# EAGLE design picoAva-Rev2 (EAGLE 6.2)
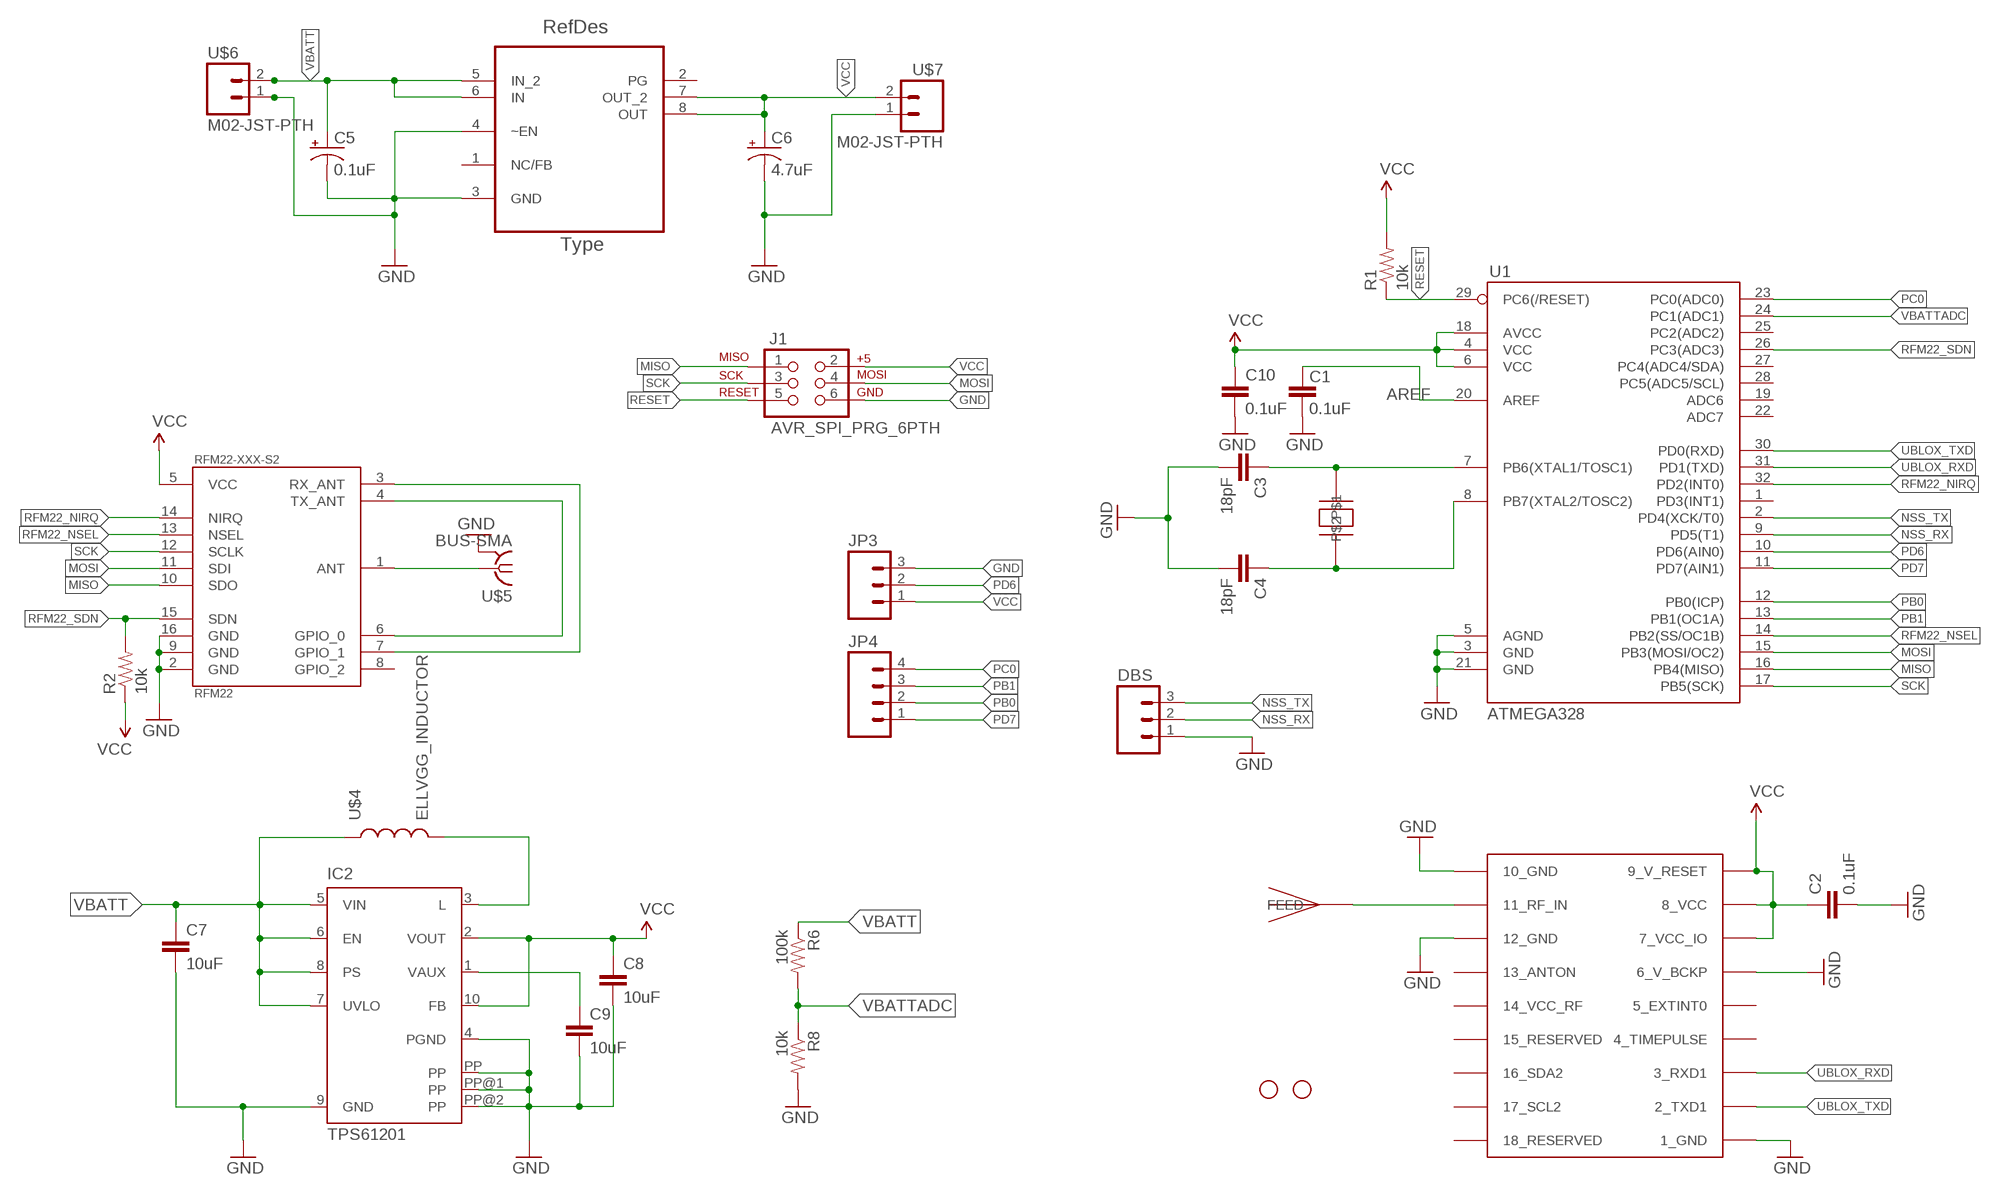
[diagram p0: schematic, sheet 1]

## Parts
C1  0.1uF  CAP0402-CAP  [0402-CAP]
C2  0.1uF  CAP0402-CAP  [0402-CAP]
C3  18pF  CAP0402-CAP  [0402-CAP]
C4  18pF  CAP0402-CAP  [0402-CAP]
C5  0.1uF  CAP_POL1206-KIT  [EIA3216-KIT]
C6  4.7uF  CAP_POL1206-KIT  [EIA3216-KIT]
C7  10uF  CAP1206  [1206]
C8  10uF  CAP1206  [1206]
C9  10uF  CAP1206  [1206]
C10  0.1uF  CAP0402-CAP  [0402-CAP]
DBS  M03PTH  [1X03]
IC2  TPS61201  [S-PDSO-N10]
J1  AVR_SPI_PRG_6PTH  [2X3]
JP1  STAND-OFF  [STAND-OFF]
JP2  STAND-OFF  [STAND-OFF]
JP3  M03PTH  [1X03]
JP4  M04PTH  [1X04]
R1  10k  RESISTOR0402-RES  [0402-RES]
R2  10k  RESISTOR0402-RES  [0402-RES]
R6  100k  RESISTOR0402-RES  [0402-RES]
R8  10k  RESISTOR0402-RES  [0402-RES]
RFM22-XXX-S2  RFM22  [RFM22-XXX-S2]
U1  ATMEGA328  ATMEGA168  [TQFP32-08]
U2  TPS76633D  [SOIC127P600X175-8N]
U$1  UBLOX_MAX-6  [UBLOX_MAX-6]
U$2  ABRACON_ABM3_CRYSTAL  [ABRACON_ABM3_CRYSTAL]
U$3  JTI_ANTENNA-1575AT43A40  [JTI_ANTENNA-1575AT43A40]
U$4  ELLVGG_INDUCTOR  [ELLVGG_INDUCTOR]
U$5  BUS-SMA  [BUS-SMA]
U$6  M02-JST-PTH  [M02-JST-PTH]
U$7  M02-JST-PTH  [M02-JST-PTH]

## Nets
AREF: C1.2 U1.20(AREF)
GND [vcc]: C1.1 C2.2 C3.2 C4.2 C5.C(-) C6.C(-) C7.2 C8.2 C9.2 C10.2 DBS.1 IC2.4(PGND) IC2.9(GND) IC2.PP IC2.PP@1(PP) IC2.PP@2(PP) J1.6 JP3.3 R8.2 RFM22-XXX-S2.2(GND) RFM22-XXX-S2.9(GND) RFM22-XXX-S2.16(GND) U1.3(GND) U1.5(AGND) U1.21(GND) U2.3(GND) U2.4(~EN) U$1.1_GND U$1.6_V_BCKP U$1.10_GND U$1.12_GND U$5.2(GND) U$5.3(GND) U$5.4(GND) U$5.5(GND) U$6.1 U$7.1
MISO: J1.1 RFM22-XXX-S2.10(SDO) U1.16(PB4(MISO))
MOSI: J1.4 RFM22-XXX-S2.11(SDI) U1.15(PB3(MOSI/OC2))
N$3: RFM22-XXX-S2.1(ANT) U$5.1
N$4: U$1.11_RF_IN U$3.FEED
N$5: RFM22-XXX-S2.3(RX_ANT) RFM22-XXX-S2.7(GPIO_1)
N$6: RFM22-XXX-S2.4(TX_ANT) RFM22-XXX-S2.6(GPIO_0)
N$7: IC2.3(L) U$4.P$2
N$9: C3.1 U1.7(PB6(XTAL1/TOSC1)) U$2.P$2
N$10: C4.1 U1.8(PB7(XTAL2/TOSC2)) U$2.P$1
N$11: C9.1 IC2.1(VAUX)
NSS_RX: DBS.2 U1.9(PD5(T1))
NSS_TX: DBS.3 U1.2(PD4(XCK/T0))
PB0: JP4.2 U1.12(PB0(ICP))
PB1: JP4.3 U1.13(PB1(OC1A))
PC0: JP4.4 U1.23(PC0(ADC0))
PD6: JP3.2 U1.10(PD6(AIN0))
PD7: JP4.1 U1.11(PD7(AIN1))
RESET: J1.5 R1.1 U1.29(PC6(/RESET))
RFM22_NIRQ: RFM22-XXX-S2.14(NIRQ) U1.32(PD2(INT0))
RFM22_NSEL: RFM22-XXX-S2.13(NSEL) U1.14(PB2(SS/OC1B))
RFM22_SDN: R2.2 RFM22-XXX-S2.15(SDN) U1.26(PC3(ADC3))
SCK: J1.3 RFM22-XXX-S2.12(SCLK) U1.17(PB5(SCK))
UBLOX_RXD: U1.31(PD1(TXD)) U$1.3_RXD1
UBLOX_TXD: U1.30(PD0(RXD)) U$1.2_TXD1
VBATT [vcc]: C5.A(+) C7.1 IC2.5(VIN) IC2.6(EN) IC2.7(UVLO) IC2.8(PS) R6.1 U2.5(IN_2) U2.6(IN) U$4.P$1 U$6.2
VBATTADC: R6.2 R8.1 U1.24(PC1(ADC1))
VCC: C2.1 C6.A(+) C8.1 C10.1 IC2.2(VOUT) IC2.10(FB) J1.2 JP3.1 R1.2 R2.1 RFM22-XXX-S2.5(VCC) U1.4(VCC) U1.6(VCC) U1.18(AVCC) U2.7(OUT_2) U2.8(OUT) U$1.7_VCC_IO U$1.8_VCC U$1.9_V_RESET U$7.2
Unconnected: RFM22-XXX-S2.8(GPIO_2) U1.1(PD3(INT1)) U1.19(ADC6) U1.22(ADC7) U1.25(PC2(ADC2)) U1.27(PC4(ADC4/SDA)) U1.28(PC5(ADC5/SCL)) U2.1(NC/FB) U2.2(PG) U$1.4_TIMEPULSE U$1.5_EXTINT0 U$1.13_ANTON U$1.14_VCC_RF U$1.15_RESERVED U$1.16_SDA2 U$1.17_SCL2 U$1.18_RESERVED

## Library data of the parts
C1-C4 C7-C10 = SparkFun:CAP: Capacitor Standard 0603 ceramic capacitor, and 0.1" leaded capacitor.
C5 C6 = SparkFun:CAP_POL: Capacitor Polarized These are standard SMD and PTH capacitors. Normally 10uF, 47uF, and 100uF in electrolytic and tantalum varieties. Always verify the external diameter of the through hole cap, it varies with capacity, voltage, and manufacturer. The EIA devices should be standard.
DBS JP3 = SparkFun:M03: Header 3 Standard 3-pin 0.1" header. Use with straight break away headers (SKU : PRT-00116), right angle break away headers (PRT-00553), swiss pins (PRT-00743), machine pins (PRT-00117), and female headers (PRT-00115). Molex polarized connector foot print use with SKU : PRT-08232 with associated crimp pins and housings.
IC2 = texas:TPS6120*: LOW INPUT VOLTAGE SYNCHRONOUS BOOST CONVERTER WITH 1.3-A SWITCHES Source: http://focus.ti.com/lit/ds/symlink/tps61200.pdf; MPN: TPS61201DRCT; OC_FARNELL: unknown; OC_NEWARK: 37M0068
J1 = SparkFun:AVR_SPI_PRG_6: AVR ISP 6 Pin This is the reduced ISP connector for AVR programming. Common on Arduino. This footprint will take up less PCB space and can be used with a 10-pin to 6-pin adapter such as SKU: BOB-08508
JP1 JP2 = SparkFun:STAND-OFF: Stand Off This is the mechanical footprint for a #4 phillips button head screw. Use the keepout ring to avoid running the screw head into surrounding components. SKU : PRT-00447
JP4 = SparkFun:M04: Header 4 Standard 4-pin 0.1" header. Use with straight break away headers (SKU : PRT-00116), right angle break away headers (PRT-00553), swiss pins (PRT-00743), machine pins (PRT-00117), and female headers (PRT-00115). Molex polarized connector foot print use with SKU : PRT-08231 with associated crimp pins and housings. 1MM SMD Version SKU: PRT-10208
R1 R2 R6 R8 = SparkFun:RESISTOR: Resistor Basic schematic elements and footprints for 0603, 1206, and PTH resistors.
RFM22-XXX-S2 = SparkFun:RFM22: *Hope RF's RFM22* Packages: RFM22-S2 (SMD)
U1 = SparkFun:ATMEGA168
U2 = ava:TPS76633D; DESCRIPTION: ULTRALOW QUIESCENT CURRENT 250-mA LOW DROPOUT VOLTAGE REGULATORS; MPN: TPS76633D; OC_FARNELL: 8461422; OC_NEWARK: 77C1060; PACKAGE: SOIC-8; SUPPLIER: Texas Instruments
U$1 = ava:UBLOX_MAX-6: UBLOX MAX-6
U$2 = ava:ABRACON_ABM3_CRYSTAL
U$3 = ava:JTI_ANTENNA-1575AT43A40
U$4 = ava:ELLVGG_INDUCTOR
U$5 = ava:BUS-SMA
U$6 U$7 = ava:M02-JST-PTH

## Net classes
0 default: width 0.203 mm
1 vcc: width 0.254 mm

## Board
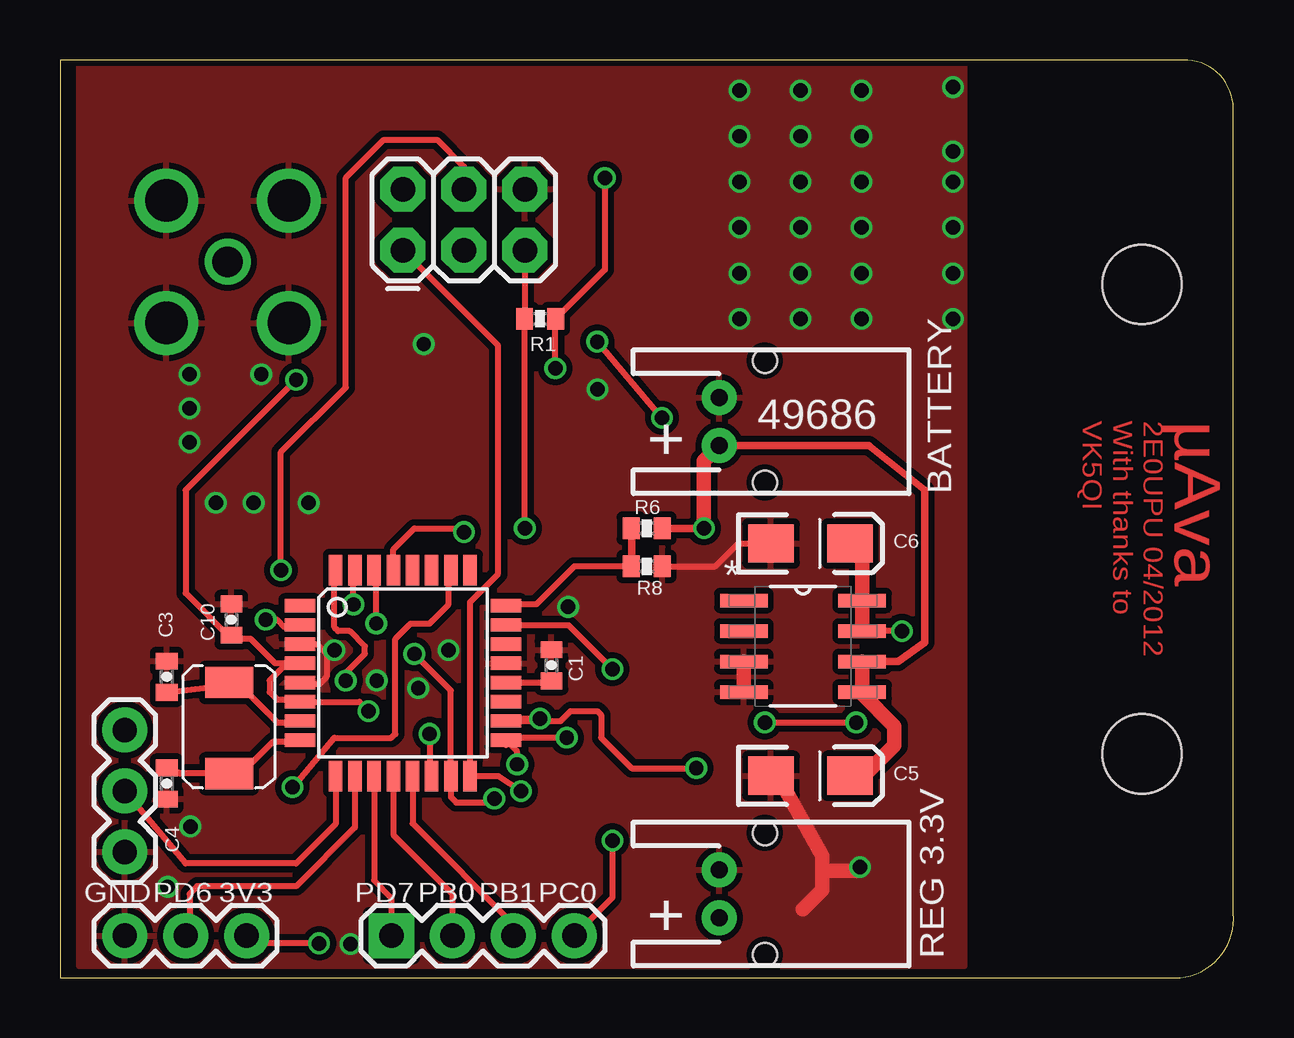
[diagram p1: board, top side]
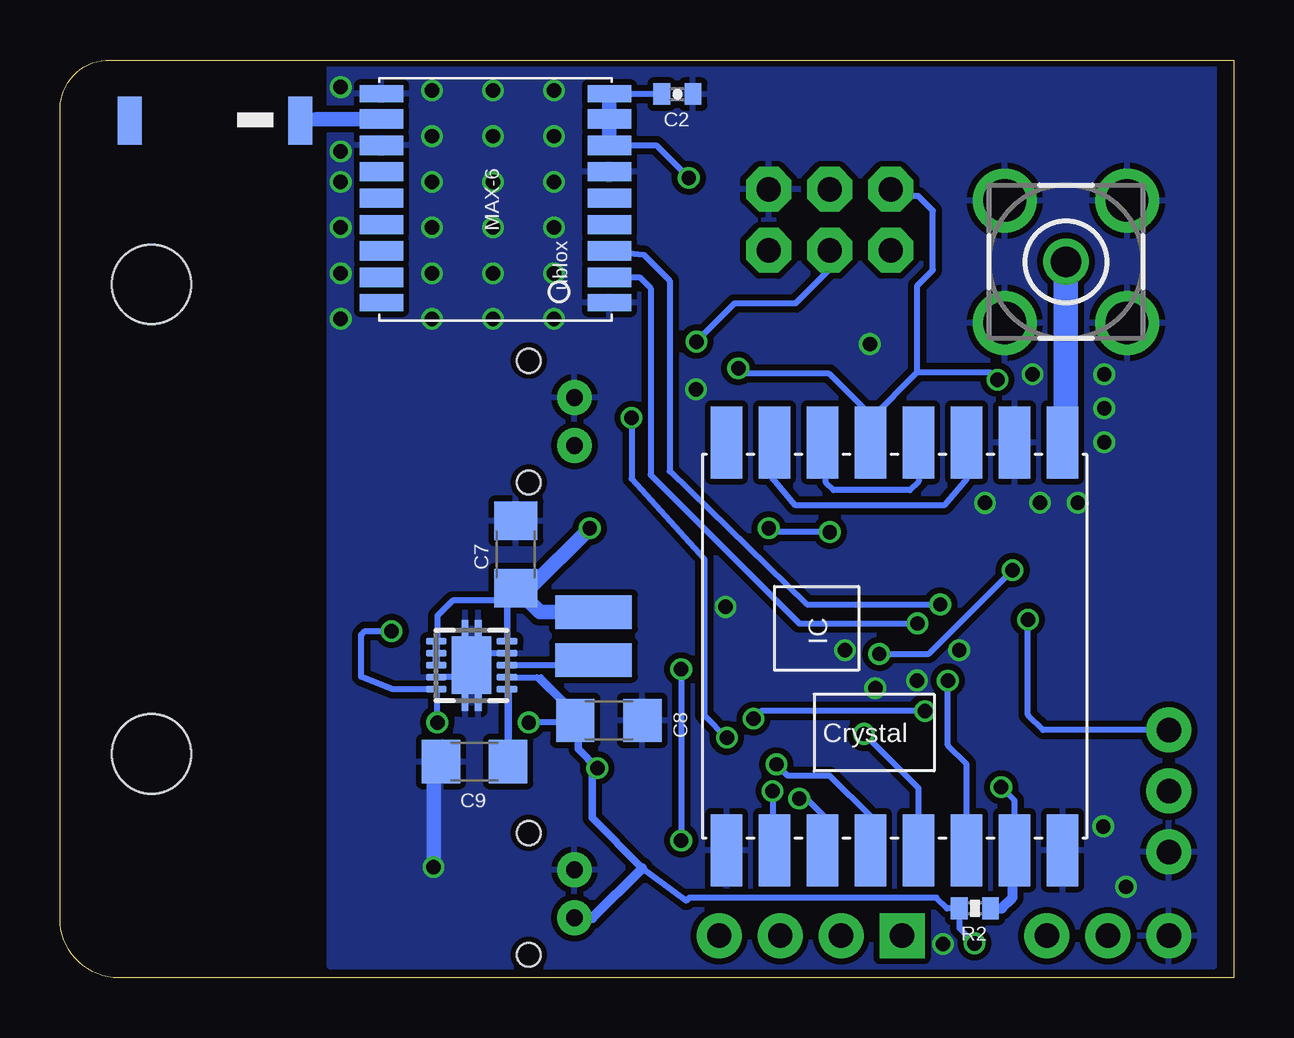
[diagram p2: board, bottom side, seen from below]

Size 48.9 x 38.25 mm. Coordinates in mm from the lower left corner, seen from the top.
Outline: 0,0 46.68,0 arc90 48.89,2.69 48.89,36.04 arc90 46.99,38.25 0,38.25 0,0
Copper layers (1*16): Top 0.035mm / dielectric 1.5mm / Bottom 0.035mm
Design rules: minimum track width 6mil, minimum drill 12mil, track to track 6mil, track to pad 6mil, pad to pad 6mil, via to via 6mil, smd to smd 0mil, copper to edge 10mil, drill to drill 10mil, minimum pad ring 10mil, minimum via ring 6mil, stop-mask expansion 2mil, vias tented up to drill 100mil, thermal gap 10mil

### Footprints (pad centres in the part's own frame; a part is rotated, then mirrored left to right if it is on the bottom)
0402-CAP = smd 0.7 x 0.9: 1 -0.65,0; 2 0.65,0
EIA3216-KIT = smd 1.9 x 1.6: A 1.65,0; C -1.65,0
1206 = smd 1.6 x 1.8: 1 -1.4,0; 2 1.4,0
1X03 = drill 1.016 pad 1.88: 1 0,0; 2 2.54,0; 3 5.08,0
S-PDSO-N10 = smd 0.28 x 0.85: 1 -1,-1.475; 2 -0.5,-1.475; 3 0,-1.475; 4 0.5,-1.475; 5 1,-1.475; 6 1,1.475; 7 0.5,1.475; 8 0,1.475; 9 -0.5,1.475; 10 -1,1.475 | smd 2.4 x 1.65: PP 0,0 | smd 3.8 x 0.28: PP@1 0,0.275; PP@2 0,-0.275
2X3 = drill 1.016 pad 1.88 octagon: 1 0,0; 2 0,2.54; 3 2.54,0; 4 2.54,2.54; 5 5.08,0; 6 5.08,2.54
STAND-OFF = hole 3.302: 0,0
1X04 = drill 1.016 pad 1.88 square: 1 0,0 | drill 1.016 pad 1.88: 2 2.54,0; 3 5.08,0; 4 7.62,0
0402-RES = smd 0.7 x 0.9: 1 -0.65,0; 2 0.65,0
RFM22-XXX-S2 = smd 3 x 1.3: 1 -8.5,7; 2 -8.5,5; 3 -8.5,3; 4 -8.5,1; 5 -8.5,-1; 6 -8.5,-3; 7 -8.5,-5; 8 -8.5,-7; 9 8.5,-7; 10 8.5,-5; 11 8.5,-3; 12 8.5,-1; 13 8.5,1; 14 8.5,3; 15 8.5,5; 16 8.5,7
TQFP32-08 = smd 1.27 x 0.559: 1 -4.293,2.8; 2 -4.293,2; 3 -4.293,1.2; 4 -4.293,0.4; 5 -4.293,-0.4; 6 -4.293,-1.2; 7 -4.293,-2; 8 -4.293,-2.8; 17 4.293,-2.8; 18 4.293,-2; 19 4.293,-1.2; 20 4.293,-0.4; 21 4.293,0.4; 22 4.293,1.2; 23 4.293,2; 24 4.293,2.8 | smd 0.559 x 1.27: 9 -2.8,-4.293; 10 -2,-4.293; 11 -1.2,-4.293; 12 -0.4,-4.293; 13 0.4,-4.293; 14 1.2,-4.293; 15 2,-4.293; 16 2.8,-4.293; 25 2.8,4.293; 26 2,4.293; 27 1.2,4.293; 28 0.4,4.293; 29 -0.4,4.293; 30 -1.2,4.293; 31 -2,4.293; 32 -2.8,4.293
SOIC127P600X175-8N = smd 1.981 x 0.559: 1 -2.464,1.905; 2 -2.464,0.635; 3 -2.464,-0.635; 4 -2.464,-1.905; 5 2.464,-1.905; 6 2.464,-0.635; 7 2.464,0.635; 8 2.464,1.905
UBLOX_MAX-6 = smd 1.8 x 0.7: 1_GND 4.95,-4.4; 9_V_RESET 4.95,4.3; 10_GND -4.55,4.3; 18_RESERVED -4.55,-4.4 | smd 1.8 x 0.8: 2_TXD1 4.95,-3.35; 3_RXD1 4.95,-2.25; 4_TIMEPULSE 4.95,-1.15; 5_EXTINT0 4.95,-0.05; 6_V_BCKP 4.95,1.05; 7_VCC_IO 4.95,2.15; 8_VCC 4.95,3.25; 11_RF_IN -4.55,3.25; 12_GND -4.55,2.15; 13_ANTON -4.55,1.05; 14_VCC_RF -4.55,-0.05; 15_RESERVED -4.55,-1.15; 16_SDA2 -4.55,-2.25; 17_SCL2 -4.55,-3.35
ABRACON_ABM3_CRYSTAL = smd 1.3 x 2: P$1 -3.4,0.1; P$2 0.4,0.1
JTI_ANTENNA-1575AT43A40 = smd 1 x 2: FEED -3.81,-1.27; NC 3.29,-1.27
ELLVGG_INDUCTOR = smd 1.4 x 3.2: P$1 -0.953,0; P$2 1.048,0
BUS-SMA = drill 1.27: 1 0,0 | drill 1.778: 2 -2.55,2.55; 3 2.55,2.55; 4 2.55,-2.55; 5 -2.55,-2.55
M02-JST-PTH = drill 0.7 pad 1.448: 1 -1,0; 2 1,0 | hole 1: -2.54,1.905; 2.54,1.905

### Placement (x,y rotation side)
C1  20.48,13.02 270 top
C2  23.18,36.83 0 bottom
C3  4.45,12.54 90 top
C4  4.45,8.09 270 top
C5  31.27,8.41 0 top
C6  31.27,18.1 0 top
C7  29.9,17.64 90 bottom
C8  26.03,10.72 0 bottom
C9  31.63,9 180 bottom
C10  7.14,14.92 90 top
DBS  2.7,5.24 90 top
IC2  31.75,13.02 90 bottom
J1  14.29,30.32 0 top
JP1  45.09,9.33 0 top
JP2  45.09,28.89 0 top
JP3  7.78,1.75 180 top
JP4  13.81,1.75 0 top
R1  20,27.46 0 top
R2  10.78,2.89 0 bottom
R6  24.45,18.73 180 top
R8  24.45,17.14 0 top
RFM22-XXX-S2  14.13,13.81 270 bottom
U1  14.29,12.7 0 top
U2  30.96,13.81 0 top
U$1  30.96,32.54 0 bottom
U$2  7.14,11.91 90 top
U$3  42.71,34.45 180 bottom
U$4  26.67,14.29 270 bottom
U$5  6.99,29.84 0 bottom
U$6  27.46,23.18 270 top
U$7  27.46,3.49 270 top

### Tracks (layer width: path | path; a pad name or v marks a point on that pad's centre or on a via)
AREF
  Top 0.254: U1.20 20.4,12.3 20.48,12.22 C1.2
GND  (via drill 0.6)
  Top 0.254: R8.2 27.31,17.15 28.26,18.1 29.53,18.1 | U1.3 10.71,13.9 11.11,13.49 11.11,12.54 10.8,12.22 10,12.22
  Top 0.61: U2.3 U2.4 | 30.96,2.86 31.75,3.65 31.75,4.45 | 31.75,4.45 31.75,5.08 29.94,8.32 C5.C | v33.34,4.6 33.18,4.45 31.75,4.45
  Bottom 0.254: IC2.9 33.2,12.54 32.54,12.54 32.07,13.02 IC2.PP@1 IC2.PP IC2.PP@2 30.98,13.52 IC2.4
  Bottom 0.61: C9.2 33.34,8.69 v33.34,4.6
  other vias: 10.36,19.79 37.21,37.12 21.17,15.46 11.43,13.65 5.43,6.3 4.49,3.78 8.38,25.15 5.39,25.15 5.39,22.32 5.39,23.73 8.07,19.8 6.49,19.8 37.21,34.44 16.19,13.65 13.2,12.39 14.93,12.07 15.16,26.41 22.4,24.52 33.4,36.98 28.32,36.98 30.86,36.98 33.4,35.08 28.32,35.08 30.86,35.08 33.4,33.17 28.32,33.17 30.86,33.17 33.4,31.27 28.32,31.27 30.86,31.27 33.4,29.36 28.32,29.36 30.86,29.36 33.4,27.46 28.32,27.46 30.86,27.46 37.21,33.17 37.21,31.27 37.21,29.36 37.21,27.46 12.11,1.4
  pour Bottom (isolate 0.254): 37.68,38.14 37.68,0.48 0.8,0.48 0.8,38.14
  pour Top (isolate 0.254): 37.68,38.14 37.68,0.48 0.8,0.48 0.8,38.14
MISO  (via drill 0.6)
  Top 0.254: v19.21,7.78 18.26,8.41 U1.16 17.09,15.66 18.26,16.83 18.26,26.35 J1.1
  Bottom 0.254: v19.21,7.78 19.21,5.39 RFM22-XXX-S2.10
MOSI  (via drill 0.6)
  Top 0.254: v18.1,7.46 17.94,7.3 16.51,7.3 16.29,7.53 U1.15 16.29,11.97 v14.76,13.49 | v9.21,16.99 9.21,21.91 11.91,24.61 11.91,33.34 13.49,34.93 15.72,34.93 16.83,33.81 J1.4
  Bottom 0.254: v18.1,7.46 17.78,7.46 16.99,6.67 16.99,5.45 RFM22-XXX-S2.11 | v14.76,13.49 12.7,13.49 v9.21,16.99
N$3
  Bottom 0.61: RFM22-XXX-S2.1 6.99,22.17
  Bottom 1.016: 6.99,22.17 U$5.1
N$4
  Bottom 0.61: U$1.11_RF_IN 38.18,35.79 U$3.FEED
N$5
  Bottom 0.254: RFM22-XXX-S2.3 11.13,20.78 12.07,19.69 18.26,19.69 19.21,20.8 19.21,22.23 RFM22-XXX-S2.7
N$6
  Bottom 0.254: RFM22-XXX-S2.4 13.13,20.69 13.49,20.32 16.67,20.32 16.99,20.64 16.99,22.17 RFM22-XXX-S2.6
N$7
  Bottom 0.254: 26.67,13.02 IC2.3
  Bottom 0.305: 26.67,13.02 U$4.P$2
N$9
  Top 0.254: U$2.P$2 7.38,12.31 9.05,10.64 10,10.64 U1.7 | C3.1 7.01,12.21
  Top 0.406: 7.01,12.13 7.01,12.21 7.01,12.29 7.04,12.29 U$2.P$2
N$10
  Top 0.254: C4.1 5,8.51 U$2.P$1 7.55,8.51 8.89,9.84 10,9.84 U1.8
N$11
  Bottom 0.305: IC2.1 30.23,11.97 C9.1
NSS_RX
  Top 0.254: U1.9 11.49,6.41 9.84,4.76 5.24,4.76 DBS.2
NSS_TX  (via drill 0.6)
  Top 0.254: v8.57,14.92 9.05,14.92 9.37,14.61 9.9,14.61 U1.2
  Bottom 0.254: DBS.3 7.94,10.32 8.57,10.95 v8.57,14.92
PB0
  Top 0.254: U1.12 13.89,5.96 16.35,3.49 JP4.2
PB1
  Top 0.254: U1.13 14.69,6.43 18.89,2.22 JP4.3
PC0  (via drill 0.6)
  Top 0.254: U1.23 21.18,14.7 v23.02,12.86 | v23.02,5.72 23.02,3.33 JP4.4
  Bottom 0.254: v23.02,12.86 v23.02,5.72
PD6
  Top 0.254: U1.10 12.29,6.26 9.84,3.81 5.72,3.81 5.4,3.49 5.4,2.06 JP3.2
PD7
  Top 0.254: U1.11 13.09,4.06 13.81,3.33 JP4.1
RESET  (via drill 0.6)
  Top 0.254: J1.5 19.37,27.46 R1.1 19.37,27.45 v19.37,18.73 | U1.29 13.89,17.86 14.76,18.73 16.67,18.73 v16.83,18.57
  Bottom 0.254: v16.83,18.57 19.21,18.57 v19.37,18.73
RFM22_NIRQ  (via drill 0.6)
  Top 0.254: U1.32 11.43,16.94 11.43,14.61 11.59,14.45 12.07,14.45 12.7,13.81 12.7,13.49 11.91,12.7 v11.91,12.38
  Bottom 0.254: RFM22-XXX-S2.14 11.13,8.91 11.91,9.68 v11.91,12.38
RFM22_NSEL  (via drill 0.6)
  Top 0.254: v15.4,10.16 15.4,8.5 U1.14
  Bottom 0.254: RFM22-XXX-S2.13 13.13,7.89 v15.4,10.16
RFM22_SDN  (via drill 0.6)
  Top 0.254: v9.68,7.94 9.84,8.1 11.43,10 13.81,10 13.97,10.16 13.97,14.13 14.61,14.76 15.4,14.76 16.19,15.56 16.19,16.83 | 16.19,16.83 16.19,16.9 U1.26 16.29,16.92 16.19,16.83 | 16.19,16.83 16.35,16.83
  Bottom 0.254: RFM22-XXX-S2.15 9.13,7.38 v9.68,7.94
  Bottom 0.406: R2.2 9.65,2.89 9.21,3.33 9.21,5.23 RFM22-XXX-S2.15
SCK  (via drill 0.6)
  Top 0.254: v19.05,8.89 19.05,9.43 U1.17 | v22.38,26.51 v25.08,23.34 | v21.11,10 18.89,10 18.57,9.68 U1.17 | 18.57,10 U1.17
  Bottom 0.254: RFM22-XXX-S2.12 15.13,6.72 16.83,8.41 18.57,8.41 v19.05,8.89 | J1.3 16.83,29.53 18.26,28.1 20.8,28.1 v22.38,26.51 | v25.08,23.34 25.08,20.8 22.07,17.46 22.07,10.95 v21.11,10
UBLOX_RXD  (via drill 0.6)
  Top 0.254: v12.22,15.56 12.22,16.93 U1.31
  Bottom 0.254: U$1.3_RXD1 24.58,30.14 23.5,29.05 23.5,21.11 17.78,15.56 v12.22,15.56
UBLOX_TXD  (via drill 0.6)
  Top 0.254: v13.18,14.76 13.18,16.9 U1.30
  Bottom 0.254: U$1.2_TXD1 24.75,29.19 24.29,28.73 24.29,20.96 18.1,14.76 v13.18,14.76
VBATT  (via drill 0.6)
  Top 0.305: U2.6 34.93,13.18 36.04,13.97 36.04,20.32 33.7,22.18 U$6.2 | R6.1 v26.83,18.73
  Top 0.61: 33.18,8.26 33.34,8.26 34.77,9.68 34.77,10.48 33.42,11.82 U2.5 U2.6 | 33.18,8.26 33.02,8.26 32.86,8.41 | C5.A 33.02,8.41 33.18,8.26 | U$6.2 26.83,21.54 v26.83,18.73
  Bottom 0.254: C7.1 30.28,16.24 IC2.5 30.28,15.67 30.32,15.72 32.54,15.72 33.18,15.08 33.18,14.06 IC2.6
  Bottom 0.305: IC2.8 IC2.7 IC2.6
  Bottom 0.61: v26.83,18.73 29.37,16.19 29.85,16.19 C7.1 28.9,15.24 U$4.P$1
VBATTADC
  Top 0.254: R6.2 | R8.1 21.43,17.15 19.84,15.56 18.64,15.56 U1.24
  Top 0.305: R8.1 23.81,17.16 R6.2
VCC  (via drill 0.6)
  Top 0.254: v29.37,10.64 v33.18,10.64 | v22.7,33.34 22.7,29.51 R1.2 20.64,27.45 v20.64,25.4 | 7.16,14.27 C10.1 7.3,14.29 7.14,14.13 5.24,16.03 5.24,20.32 v9.84,24.92 | C10.1 7.16,14.27 | 7.16,14.27 7.3,14.13 7.94,14.13 8.97,13.1 U1.4 9.45,13.1 8.73,12.38 8.73,11.91 9.05,11.59 9.91,11.59 U1.6 12.47,11.5 v12.86,11.11 | v20,10.8 18.68,10.8 U1.18 20.86,10.7 21.27,11.11 22.38,11.11 22.54,10.95 22.54,10 23.81,8.73 v26.51,8.73 | v35.08,14.45 33.5,14.45 | v10.8,1.43 8.26,1.43 JP3.1
  Top 0.406: 33.5,14.45 U2.7
  Top 0.61: U2.7 U2.8 33.42,17.6 C6.A
  Bottom 0.254: 27.78,10.64 27.94,10.8 27.94,11.43 29.03,12.52 IC2.2 28.87,12.52 27.62,11.27 27.62,10.91 C8.1 27.31,10.59 | 27.78,10.64 v29.37,10.64 | v33.18,10.64 33.18,11.97 IC2.10 35.04,12.02 36.35,12.54 36.35,14.29 36.2,14.45 v35.08,14.45 | C2.1 26.02,36.83 | 15.08,22.36 RFM22-XXX-S2.5 15.13,23.29 | U$1.7_VCC_IO 24.06,34.69 v22.7,33.34 | v12.86,11.11 19.69,11.11 v20,10.8 | 27.46,10.32 27.62,10.32 27.78,10.48 27.78,10.64 | 15.13,23.29 13.18,25.24 | 13.18,25.24 10.16,25.24 v9.84,24.92 | 15.13,23.29 15.13,23.45 16.85,25.18 20.56,25.18 20.56,25.32 v20.64,25.4 | 13.18,25.24 13.18,28.85 12.53,29.5 12.53,31.97 13.15,32.59 14.01,32.59 J1.2 | 24.65,4.57 22.81,3.21 22.68,3.33 12.38,3.33 11.94,2.89 R2.1 11.43,2.06 v10.8,1.43
  Bottom 0.305: 27.31,10.59 27.31,9.53 v26.51,8.73 26.73,8.51 26.73,6.65 24.65,4.57
  Bottom 0.406: U$7.2 26.72,2.49 24.65,4.57
  Bottom 0.61: U$1.9_V_RESET 26.02,36.83 | 26.02,36.83 26.04,36.83 | U$1.7_VCC_IO U$1.8_VCC 26.01,36.82 26.02,36.83

### Text on the board
Top: VK5QI | With thanks to | 2E0UPU 04/2012 | µAva
tPlace: 49686 | + | BATTERY | GND | PD6 | 3V3 | PD7 | PB0 | PB1 | PC0 | + | REG 3.3V
tStop: VK5QI | With thanks to | 2E0UPU 04/2012 | µAva